# Altium schematic sheet fpga-tx2.SchDoc: Transmitter FPGA
size Legal; CheckedBy: J. Brinton; CompanyName: Signal Laboratories, Inc.; DrawnBy: J. Brinton; Engineer: J. Brinton; Address1: 3479 Edison Way; Address2: Menlo Park CA 94025; Address3: +1 (877) 778-8435; Address4: siglabs.com; DocumentNumber: 41; Revision: 2b; SheetNumber: 42; SheetTotal: 58
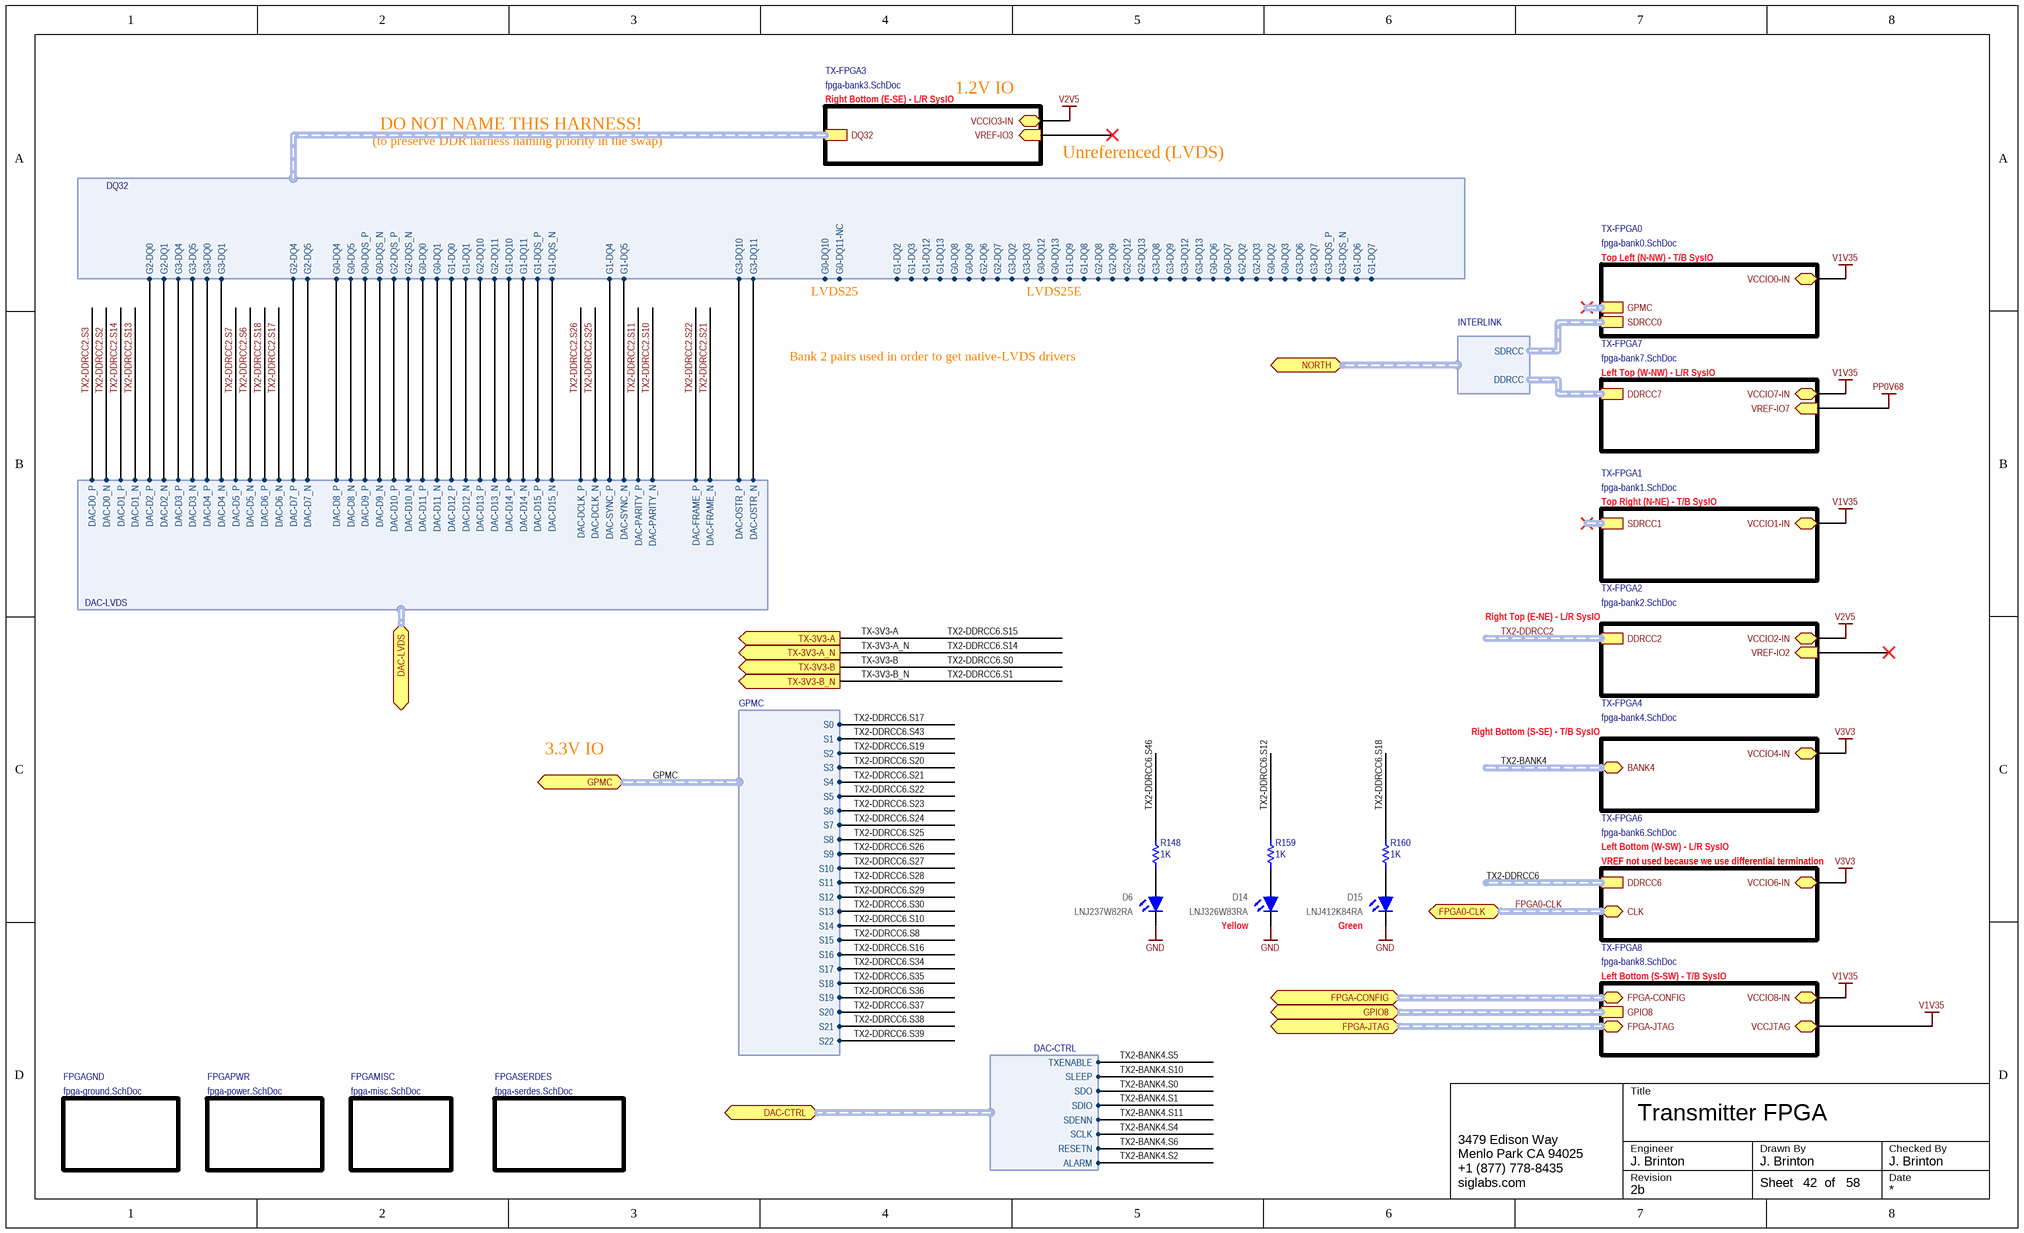
[diagram p0: fpga-tx2.SchDoc]

## Parts
D6  LNJ237W82RA  [0603_LED]
D14  LNJ326W83RA  [0603_LED]
D15  LNJ412K84RA  [0603_LED]
R148  value 1K  [0402]  (hidden comment: RC0402FR-071KL)
R159  value 1K  [0402]  (hidden comment: RC0402FR-071KL)
R160  value 1K  [0402]  (hidden comment: RC0402FR-071KL)

## Sub-sheets
FPGAGND = fpga-ground.SchDoc: no entries
FPGAMISC = fpga-misc.SchDoc: no entries
FPGAPWR = fpga-power.SchDoc: no entries
FPGASERDES = fpga-serdes.SchDoc: no entries
TX-FPGA0 = fpga-bank0.SchDoc: GPMC (harness GPMC), SDRCC0 (harness SDRCC), VCCIO0-IN
TX-FPGA1 = fpga-bank1.SchDoc: SDRCC1 (harness SDRCC), VCCIO1-IN
TX-FPGA2 = fpga-bank2.SchDoc: DDRCC2 (harness DDRCC), VCCIO2-IN, VREF-IO2 (in)
TX-FPGA3 = fpga-bank3.SchDoc: DQ32 (harness DQ32), VREF-IO3 (in), VCCIO3-IN
TX-FPGA4 = fpga-bank4.SchDoc: VCCIO4-IN, BANK4 (harness BANK4)
TX-FPGA6 = fpga-bank6.SchDoc: DDRCC6 (harness DDRCC), VCCIO6-IN, CLK (harness CLK-LVPECL33)
TX-FPGA7 = fpga-bank7.SchDoc: DDRCC7 (harness DDRCC), VREF-IO7 (in), VCCIO7-IN
TX-FPGA8 = fpga-bank8.SchDoc: GPIO8 (harness GPIO8), FPGA-CONFIG (harness CONF_1V5), FPGA-JTAG (harness FPGA-JTAG), VCCJTAG, VCCIO8-IN

## Ports
DAC-CTRL (harness DAC-CTRL), DAC-LVDS (harness DAC-LVDS), FPGA0-CLK (harness CLK-LVPECL33), FPGA-CONFIG (harness CONF_1V5), FPGA-JTAG (harness FPGA-JTAG), GPIO8 (harness GPIO8), GPMC (harness GPMC), NORTH (harness INTERLINK), TX-3V3-A (out), TX-3V3-A_N (out), TX-3V3-B (out), TX-3V3-B_N (out)

## Harnesses
INTERLINK: SDRCC, DDRCC
GPMC: S0, S1, S2, S3, S4, S5, S6, S7, S8, S9, S10, S11, S12, S13, S14, S15, S16, S17, S18, S19, S20, S21, S22
DAC-LVDS: DAC-D0_P, DAC-D0_N, DAC-D1_P, DAC-D1_N, DAC-D2_P, DAC-D2_N, DAC-D3_P, DAC-D3_N, DAC-D4_P, DAC-D4_N, DAC-D5_P, DAC-D5_N, DAC-D6_P, DAC-D6_N, DAC-D7_P, DAC-D7_N, DAC-D8_P, DAC-D8_N, DAC-D9_P, DAC-D9_N, DAC-D10_P, DAC-D10_N, DAC-D11_P, DAC-D11_N, DAC-D12_P, DAC-D12_N, DAC-D13_P, DAC-D13_N, DAC-D14_P, DAC-D14_N, DAC-D15_P, DAC-D15_N, DAC-DCLK_P, DAC-DCLK_N, DAC-SYNC_P, DAC-SYNC_N, DAC-PARITY_P, DAC-PARITY_N, DAC-FRAME_P, DAC-FRAME_N, DAC-OSTR_P, DAC-OSTR_N
DQ32: G0-DQS_P, G0-DQS_N, G0-DQ0, G0-DQ1, G0-DQ2, G0-DQ3, G0-DQ4, G0-DQ5, G0-DQ6, G0-DQ7, G0-DQ8, G0-DQ9, G0-DQ10, G0-DQ11-NC, G0-DQ12, G0-DQ13, G1-DQS_P, G1-DQS_N, G1-DQ0, G1-DQ1, G1-DQ2, G1-DQ3, G1-DQ4, G1-DQ5, G1-DQ6, G1-DQ7, G1-DQ8, G1-DQ9, G1-DQ10, G1-DQ11, G1-DQ12, G1-DQ13, G2-DQS_P, G2-DQS_N, G2-DQ0, G2-DQ1, G2-DQ2, G2-DQ3, G2-DQ4, G2-DQ5, G2-DQ6, G2-DQ7, G2-DQ8, G2-DQ9, G2-DQ10, G2-DQ11, G2-DQ12, G2-DQ13, G3-DQS_P, G3-DQS_N, G3-DQ0, G3-DQ1, G3-DQ2, G3-DQ3, G3-DQ4, G3-DQ5, G3-DQ6, G3-DQ7, G3-DQ8, G3-DQ9, G3-DQ10, G3-DQ11, G3-DQ12, G3-DQ13
DAC-CTRL: ALARM, RESETN, SCLK, SDENN, SDIO, SDO, SLEEP, TXENABLE

## Nets
GND: D6.2(K) D14.2(K) D15.2(K)
PP0V68: sheet TX-FPGA7/VREF-IO7
V1V35: sheet TX-FPGA0/VCCIO0-IN, sheet TX-FPGA1/VCCIO1-IN, sheet TX-FPGA7/VCCIO7-IN, sheet TX-FPGA8/VCCJTAG, sheet TX-FPGA8/VCCIO8-IN
V2V5: sheet TX-FPGA2/VCCIO2-IN, sheet TX-FPGA3/VCCIO3-IN
V3V3: sheet TX-FPGA6/VCCIO6-IN, sheet TX-FPGA4/VCCIO4-IN
TX2-BANK4.S0: port DAC-CTRL.SDO
TX2-BANK4.S1: port DAC-CTRL.SDIO
TX2-BANK4.S2: port DAC-CTRL.ALARM
TX2-BANK4.S4: port DAC-CTRL.SCLK
TX2-BANK4.S5: port DAC-CTRL.TXENABLE
TX2-BANK4.S6: port DAC-CTRL.RESETN
TX2-BANK4.S10: port DAC-CTRL.SLEEP
TX2-BANK4.S11: port DAC-CTRL.SDENN
TX2-DDRCC2.S2: port DAC-LVDS.DAC-D0_N
TX2-DDRCC2.S3: port DAC-LVDS.DAC-D0_P
TX2-DDRCC2.S6: port DAC-LVDS.DAC-D5_N
TX2-DDRCC2.S7: port DAC-LVDS.DAC-D5_P
TX2-DDRCC2.S10: port DAC-LVDS.DAC-PARITY_N
TX2-DDRCC2.S11: port DAC-LVDS.DAC-PARITY_P
TX2-DDRCC2.S13: port DAC-LVDS.DAC-D1_N
TX2-DDRCC2.S14: port DAC-LVDS.DAC-D1_P
TX2-DDRCC2.S17: port DAC-LVDS.DAC-D6_N
TX2-DDRCC2.S18: port DAC-LVDS.DAC-D6_P
TX2-DDRCC2.S21: port DAC-LVDS.DAC-FRAME_N
TX2-DDRCC2.S22: port DAC-LVDS.DAC-FRAME_P
TX2-DDRCC2.S25: port DAC-LVDS.DAC-DCLK_N
TX2-DDRCC2.S26: port DAC-LVDS.DAC-DCLK_P
TX2-DDRCC6.S8: port GPMC.S15  [project net GPMC.S15]
TX2-DDRCC6.S10: port GPMC.S14  [project net GPMC.S14]
TX2-DDRCC6.S12: R159.2
TX2-DDRCC6.S16: port GPMC.S16  [project net GPMC.S16]
TX2-DDRCC6.S17: port GPMC.S0  [project net GPMC.S0]
TX2-DDRCC6.S18: R160.2
TX2-DDRCC6.S19: port GPMC.S2  [project net GPMC.S2]
TX2-DDRCC6.S20: port GPMC.S3  [project net GPMC.S3]
TX2-DDRCC6.S21: port GPMC.S4  [project net GPMC.S4]
TX2-DDRCC6.S22: port GPMC.S5  [project net GPMC.S5]
TX2-DDRCC6.S23: port GPMC.S6  [project net GPMC.S6]
TX2-DDRCC6.S24: port GPMC.S7  [project net GPMC.S7]
TX2-DDRCC6.S25: port GPMC.S8  [project net GPMC.S8]
TX2-DDRCC6.S26: port GPMC.S9  [project net GPMC.S9]
TX2-DDRCC6.S27: port GPMC.S10  [project net GPMC.S10]
TX2-DDRCC6.S28: port GPMC.S11  [project net GPMC.S11]
TX2-DDRCC6.S29: port GPMC.S12  [project net GPMC.S12]
TX2-DDRCC6.S30: port GPMC.S13  [project net GPMC.S13]
TX2-DDRCC6.S34: port GPMC.S17  [project net GPMC.S17]
TX2-DDRCC6.S35: port GPMC.S18  [project net GPMC.S18]
TX2-DDRCC6.S36: port GPMC.S19  [project net GPMC.S19]
TX2-DDRCC6.S37: port GPMC.S20  [project net GPMC.S20]
TX2-DDRCC6.S38: port GPMC.S21  [project net GPMC.S21]
TX2-DDRCC6.S39: port GPMC.S22  [project net GPMC.S22]
TX2-DDRCC6.S43: port GPMC.S1  [project net GPMC.S1]
TX2-DDRCC6.S46: R148.2
TX-3V3-A: port TX-3V3-A  [also labelled TX2-DDRCC6.S15]
TX-3V3-A_N: port TX-3V3-A_N  [also labelled TX2-DDRCC6.S14]
TX-3V3-B: port TX-3V3-B  [also labelled TX2-DDRCC6.S0]
TX-3V3-B_N: port TX-3V3-B_N  [also labelled TX2-DDRCC6.S1]
NetD6_1: D6.1(A) R148.1
NetD14_1: D14.1(A) R159.1
NetD15_1: D15.1(A) R160.1
(unnamed): port DAC-LVDS.DAC-D2_P, sheet TX-FPGA3/DQ32.G2-DQ0
(unnamed): port DAC-LVDS.DAC-D2_N, sheet TX-FPGA3/DQ32.G2-DQ1
(unnamed): port DAC-LVDS.DAC-D3_P, sheet TX-FPGA3/DQ32.G3-DQ4
(unnamed): port DAC-LVDS.DAC-D3_N, sheet TX-FPGA3/DQ32.G3-DQ5
(unnamed): port DAC-LVDS.DAC-D4_P, sheet TX-FPGA3/DQ32.G3-DQ0
(unnamed): port DAC-LVDS.DAC-D4_N, sheet TX-FPGA3/DQ32.G3-DQ1
(unnamed): port DAC-LVDS.DAC-D7_P, sheet TX-FPGA3/DQ32.G2-DQ4
(unnamed): port DAC-LVDS.DAC-D7_N, sheet TX-FPGA3/DQ32.G2-DQ5
(unnamed): port DAC-LVDS.DAC-D8_P, sheet TX-FPGA3/DQ32.G0-DQ4
(unnamed): port DAC-LVDS.DAC-D8_N, sheet TX-FPGA3/DQ32.G0-DQ5
(unnamed): port DAC-LVDS.DAC-D9_P, sheet TX-FPGA3/DQ32.G0-DQS_P
(unnamed): port DAC-LVDS.DAC-D9_N, sheet TX-FPGA3/DQ32.G0-DQS_N
(unnamed): port DAC-LVDS.DAC-D10_P, sheet TX-FPGA3/DQ32.G2-DQS_P
(unnamed): port DAC-LVDS.DAC-D10_N, sheet TX-FPGA3/DQ32.G2-DQS_N
(unnamed): port DAC-LVDS.DAC-D11_P, sheet TX-FPGA3/DQ32.G0-DQ0
(unnamed): port DAC-LVDS.DAC-D11_N, sheet TX-FPGA3/DQ32.G0-DQ1
(unnamed): port DAC-LVDS.DAC-D12_P, sheet TX-FPGA3/DQ32.G1-DQ0
(unnamed): port DAC-LVDS.DAC-D12_N, sheet TX-FPGA3/DQ32.G1-DQ1
(unnamed): port DAC-LVDS.DAC-D13_P, sheet TX-FPGA3/DQ32.G2-DQ10
(unnamed): port DAC-LVDS.DAC-D13_N, sheet TX-FPGA3/DQ32.G2-DQ11
(unnamed): port DAC-LVDS.DAC-D14_P, sheet TX-FPGA3/DQ32.G1-DQ10
(unnamed): port DAC-LVDS.DAC-D14_N, sheet TX-FPGA3/DQ32.G1-DQ11
(unnamed): port DAC-LVDS.DAC-D15_P, sheet TX-FPGA3/DQ32.G1-DQS_P
(unnamed): port DAC-LVDS.DAC-D15_N, sheet TX-FPGA3/DQ32.G1-DQS_N
(unnamed): port DAC-LVDS.DAC-SYNC_P, sheet TX-FPGA3/DQ32.G1-DQ4
(unnamed): port DAC-LVDS.DAC-SYNC_N, sheet TX-FPGA3/DQ32.G1-DQ5
(unnamed): port DAC-LVDS.DAC-OSTR_P, sheet TX-FPGA3/DQ32.G3-DQ10
(unnamed): port DAC-LVDS.DAC-OSTR_N, sheet TX-FPGA3/DQ32.G3-DQ11

## Buses and harness runs
harness FPGA0-CLK = port FPGA0-CLK = sheet TX-FPGA6/CLK
harness GPMC = port GPMC
harness port FPGA-CONFIG = sheet TX-FPGA8/FPGA-CONFIG
harness port FPGA-JTAG = sheet TX-FPGA8/FPGA-JTAG
harness port GPIO8 = sheet TX-FPGA8/GPIO8
harness TX2-BANK4 = sheet TX-FPGA4/BANK4
harness TX2-DDRCC2 = sheet TX-FPGA2/DDRCC2
harness TX2-DDRCC6 = sheet TX-FPGA6/DDRCC6

## Notes on the sheet
- Right Bottom (E-SE) - L/R SysIO
- 1.2V IO
- (to preserve DDR harness naming priority in the swap)
- DO NOT NAME THIS HARNESS!
- Unreferenced (LVDS)
- LVDS25
- LVDS25E
- Top Left (N-NW) - T/B SysIO
- Bank 2 pairs used in order to get native-LVDS drivers
- Left Top (W-NW) - L/R SysIO
- Top Right (N-NE) - T/B SysIO
- Right Top (E-NE) - L/R SysIO
- Right Bottom (S-SE) - T/B SysIO
- 3.3V IO
- Left Bottom (W-SW) - L/R SysIO
- VREF not used because we use differential termination
- (near D14) Yellow
- (near D15) Green
- Left Bottom (S-SW) - T/B SysIO
- Title
- Engineer
- Revision
- Drawn By
- Checked By
- Date
- Sheet
- of

## Library data of the parts
D6 = LED0603RD: LED, SMT 0603, Color Red, 5mA, 1.85V; Manufacturer: Panasonic; Manufacturer P/N: LNJ237W82RA; Package: 0603 Polarized
D14 = LED0603GR: LED, SMT 0603, Color Green, 10mA, 2.05V; Manufacturer: Panasonic; Manufacturer P/N: LNJ326W83RA; Package: 0603 Polarized
D15 = LED0603Y: LED, SMT 0603, Color Yellow, 10mA, 2.05V; Manufacturer: Panasonic; Manufacturer P/N: LNJ412K84RA; Package: 0603 Polarized
R148 R159 R160 = RES 0402: Thick Film Resistor 1k ±1% 0402; Manufacturer: Yageo; Tr: -55:155; Package: 0402; Manufacturer P/N: RC0402FR-071KL; Do Not Place: *; Tolerance: ±1%